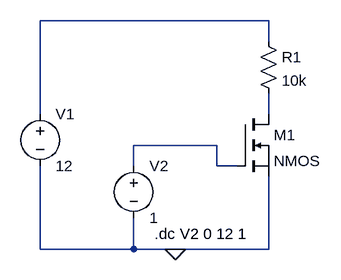
[diagram p0: schematic ex3a.asc]
ex3a.asc, the LTspice schematic file:
Version 4
SHEET 1 880 680
WIRE 224 -16 -128 -16
WIRE 224 16 224 -16
WIRE -128 128 -128 -16
WIRE 224 128 224 96
WIRE 144 176 16 176
WIRE 16 208 16 176
WIRE 144 208 144 176
WIRE 176 208 144 208
WIRE -128 336 -128 208
WIRE 16 336 16 288
WIRE 16 336 -128 336
WIRE 80 336 16 336
WIRE 224 336 224 224
WIRE 224 336 80 336
FLAG 80 336 0
SYMBOL res 208 0 R0
SYMATTR InstName R1
SYMATTR Value 10k
SYMBOL voltage -128 112 R0
WINDOW 123 0 0 Left 2
WINDOW 39 0 0 Left 2
SYMATTR InstName V1
SYMATTR Value 12
SYMBOL nmos 176 128 R0
SYMATTR InstName M1
SYMBOL voltage 16 192 R0
WINDOW 123 0 0 Left 2
WINDOW 39 0 0 Left 2
SYMATTR InstName V2
SYMATTR Value 1
TEXT 48 312 Left 2 !.dc V2 0 12 1

The netlist it stands for:
* ex3a.asc
R1 N001 N002 10k
V1 N001 0 12
M1 N002 N003 0 0 NMOS
V2 N003 0 1
.model NMOS NMOS
.model PMOS PMOS
.lib standard.mos
.dc V2 0 12 1
.backanno
.end